# Altium schematic sheet Eurocard VME 3U (3.937 x 8.660 inches).schdoc: Eurocard VME 3U (3.937 x 8.660 inches)
size D; Organization: Organization; Address1: Address1; Address2: Address2; Address3: Address3; Address4: Address4; DocumentNumber: 1; Revision: 0; SheetNumber: 2; SheetTotal: 2
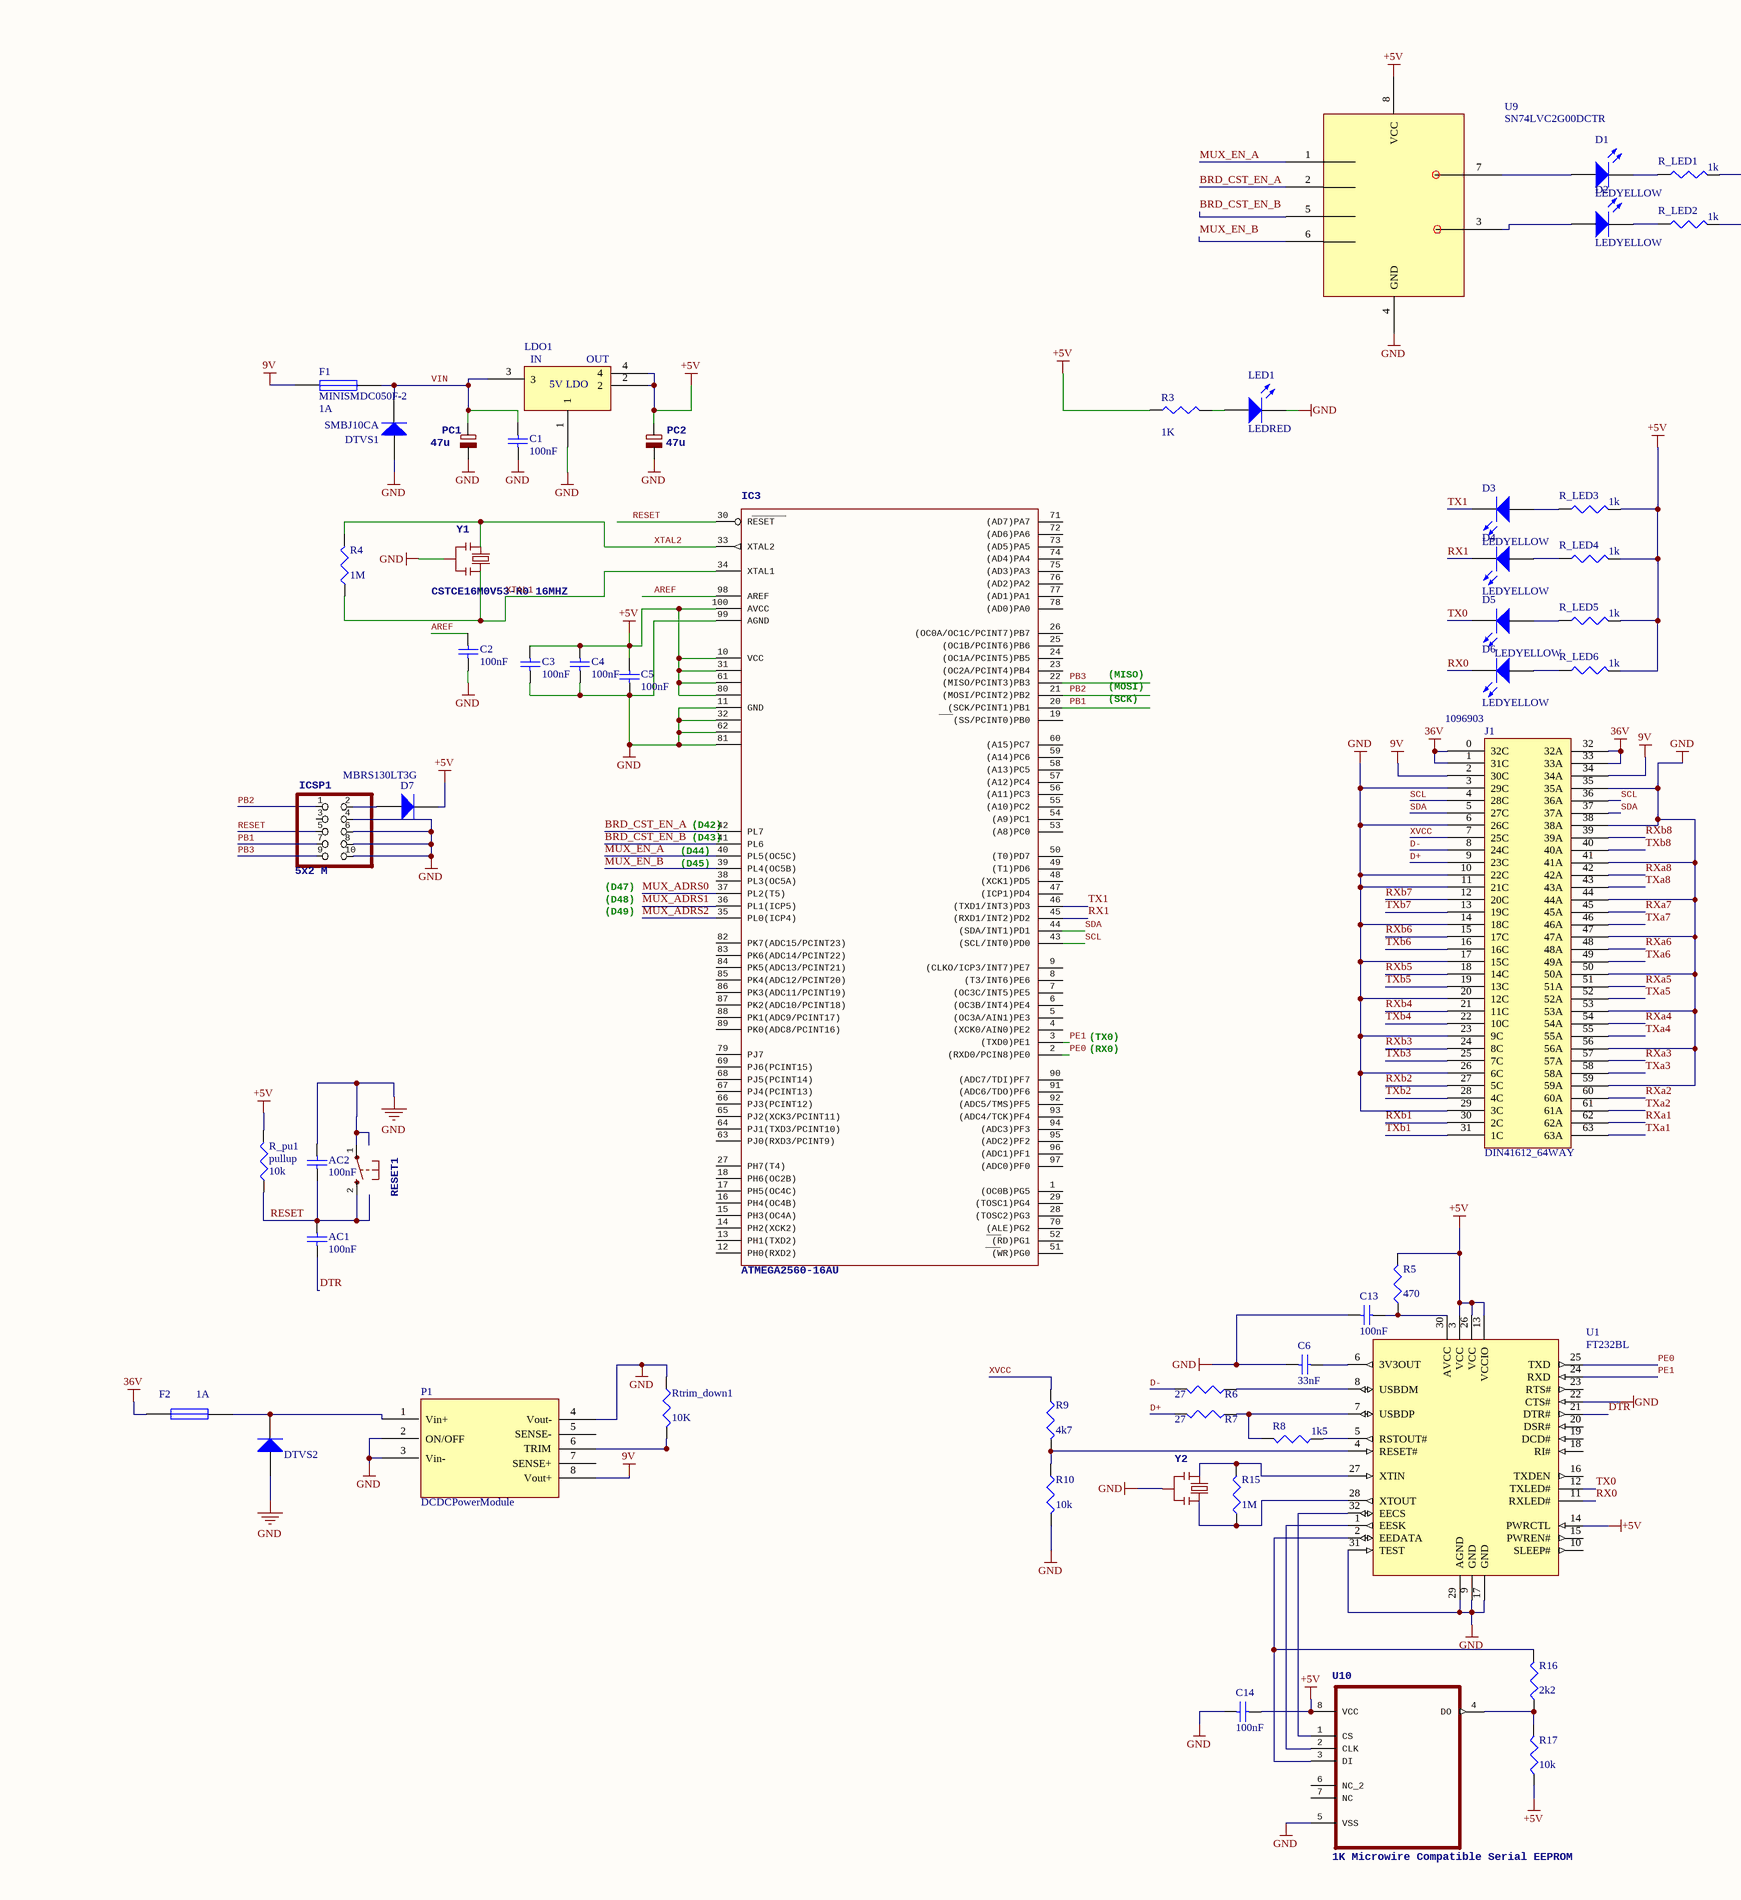
[diagram p0: Eurocard VME 3U (3.937 x 8.660 inches).schdoc, left]
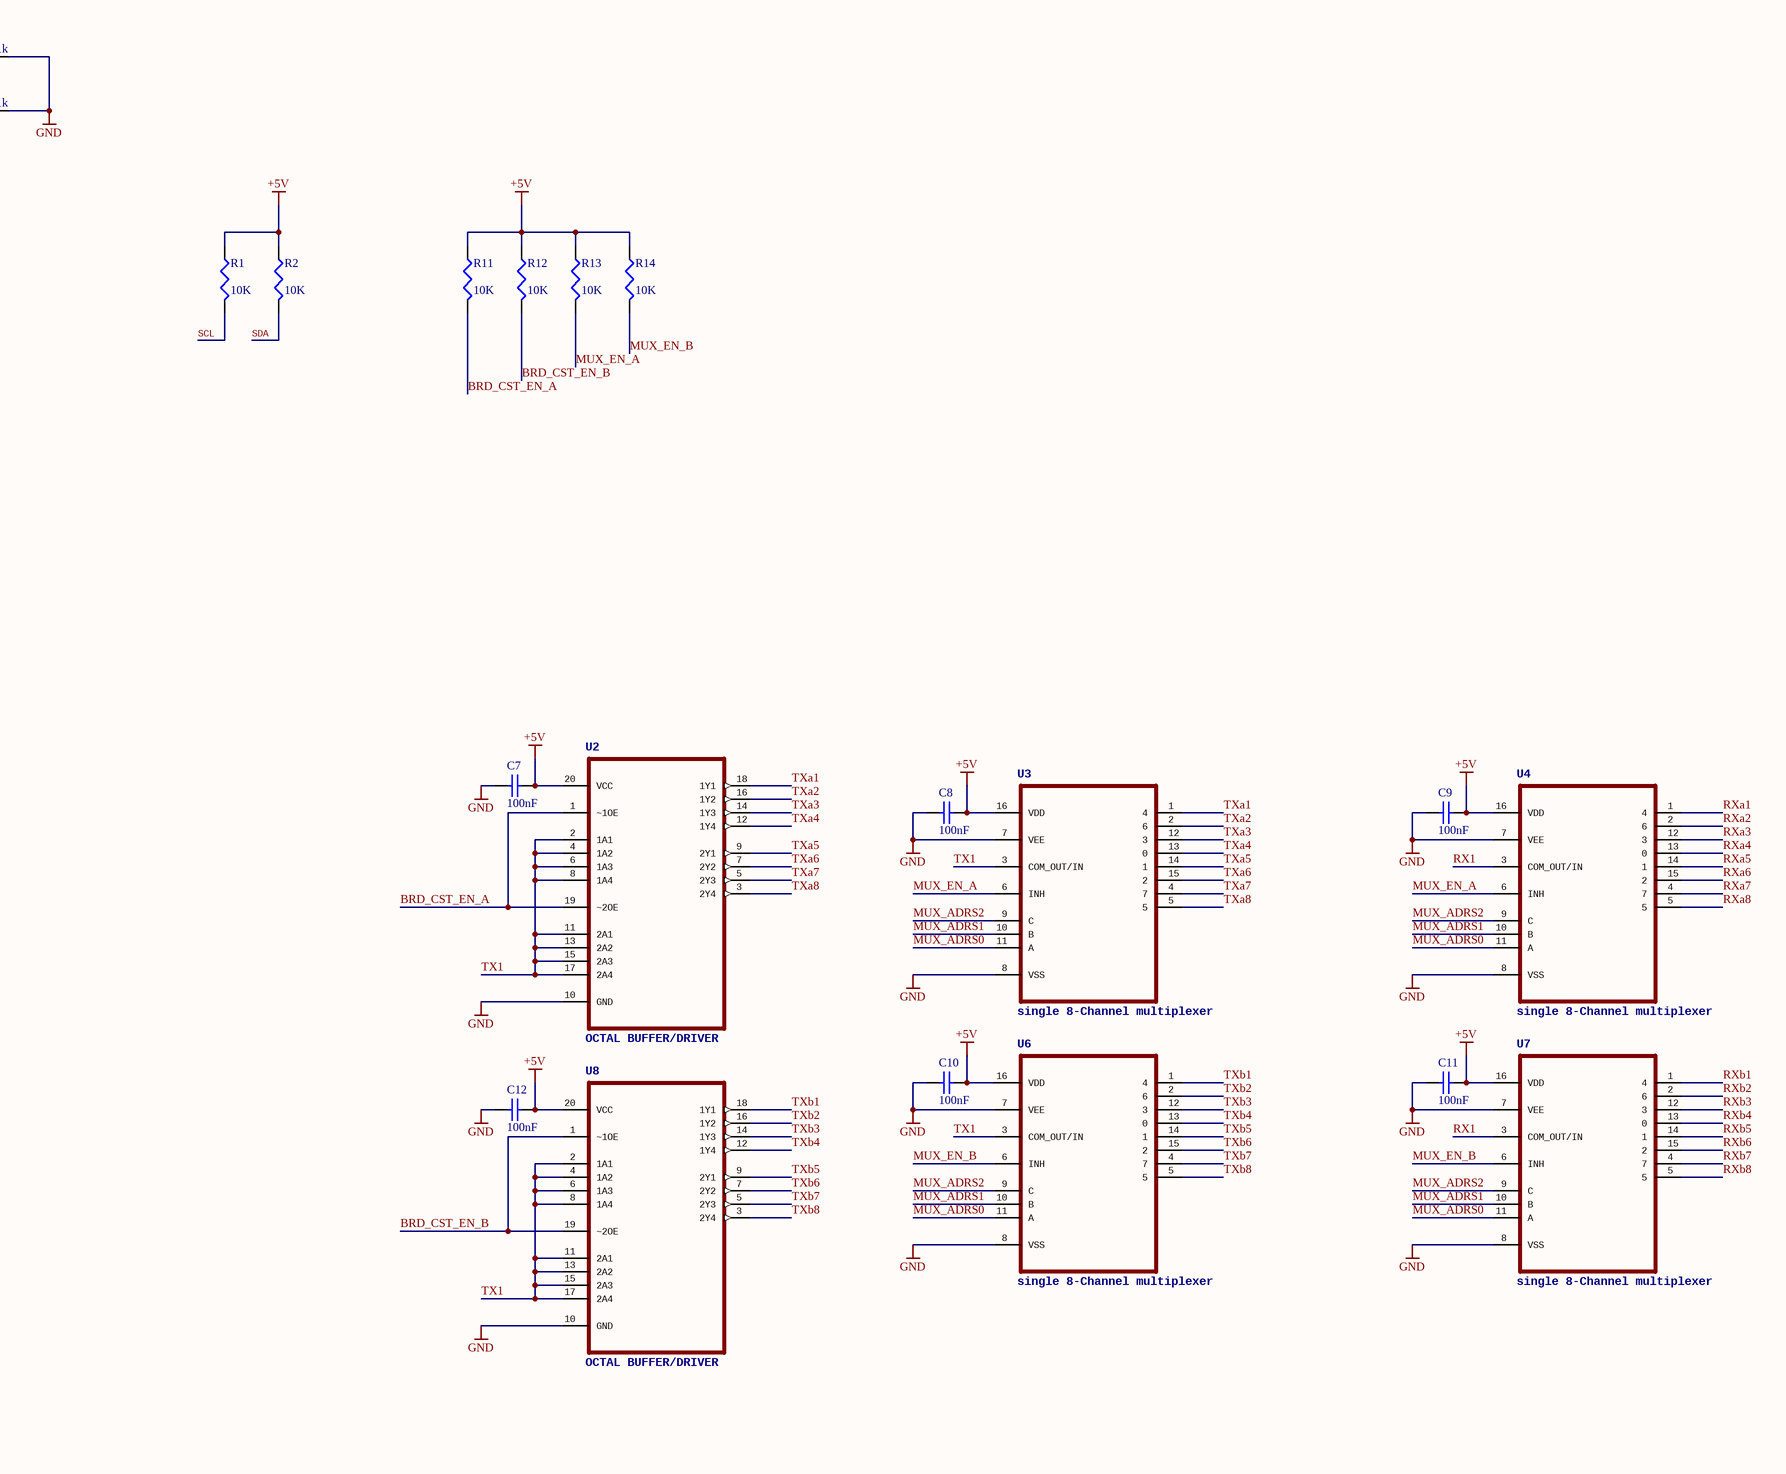
[diagram p1: Eurocard VME 3U (3.937 x 8.660 inches).schdoc, right]

## Parts
AC1  value 100nF  [1608[0603]]  (hidden comment: Cap Semi)
AC2  value 100nF  [1608[0603]]  (hidden comment: Cap Semi)
C1  value 100nF  [1608[0603]]  (hidden comment: Cap Semi)
C2  value 100nF  [1608[0603]]  (hidden comment: Cap Semi)
C3  value 100nF  [1608[0603]]  (hidden comment: Cap Semi)
C4  value 100nF  [1608[0603]]  (hidden comment: Cap Semi)
C5  value 100nF  [1608[0603]]  (hidden comment: Cap Semi)
C6  value 33nF  [1608[0603]]  (hidden comment: Cap Semi)
C7  value 100nF  [1608[0603]]
C8  value 100nF  [1608[0603]]
C9  value 100nF  [1608[0603]]
C10  value 100nF  [1608[0603]]
C11  value 100nF  [1608[0603]]
C12  value 100nF  [1608[0603]]
C13  value 100nF  [1608[0603]]  (hidden comment: Cap Semi)
C14  value 100nF  [1608[0603]]  (hidden comment: Cap Semi)
D1  LEDYELLOW  [LEDYELLOW]
D2  LEDYELLOW  [LEDYELLOW]
D3  LEDYELLOW  [LEDYELLOW]
D4  LEDYELLOW  [LEDYELLOW]
D5  LEDYELLOW  [LEDYELLOW]
D6  LEDYELLOW  [LEDYELLOW]
D7  MBRS130LT3G  [SMB-403A]
DTVS1  SMBJ10CA  [DO-214AA]
DTVS2  SMBJ48A  [SMBJ]  (value not drawn)
F1  MINISMDC050F-2  Tripping current: 1A  [MF-MSMF1]
F2  Tripping current: 1A  [MC33192]
IC3  ATMEGA2560-16AU  [100A_N]
ICSP1  5x2 M  [2X05]
J1  DIN41612_64WAY  Supplier Part Number 1: 1096903  [09 03 164 6919]
LDO1  LDO_5V  [SOT223]  (value not drawn)
LED1  LEDRED  [LEDRED]
P1  DCDCPowerModule  [EHHD006A0B41-HZ]
PC1  47u  [PANASONIC_D]
PC2  47u  [PANASONIC_D]
R1  value 10K  [J1-0603]
R2  value 10K  [J1-0603]
R3  value 1K  [J1-0603]
R4  value 1M  [J1-0603]
R5  value 470  [J1-0603]
R6  value 27  [J1-0603]
R7  value 27  [J1-0603]
R8  value 1k5  [J1-0603]
R9  value 4k7  [J1-0603]
R10  value 10k  [J1-0603]
R11  value 10K  [J1-0603]
R12  value 10K  [J1-0603]
R13  value 10K  [J1-0603]
R14  value 10K  [J1-0603]
R15  value 1M  [J1-0603]
R16  value 2k2  [J1-0603]
R17  value 10k  [J1-0603]
R_LED1  value 1k  [J1-0603]  (hidden comment: Res3)
R_LED2  value 1k  [J1-0603]  (hidden comment: Res3)
R_LED3  value 1k  [J1-0603]  (hidden comment: Res3)
R_LED4  value 1k  [J1-0603]  (hidden comment: Res3)
R_LED5  value 1k  [J1-0603]  (hidden comment: Res3)
R_LED6  value 1k  [J1-0603]  (hidden comment: Res3)
R_pu1  pullup  value 10k  [J1-0603]
RESET1  PB_RST  [1-1825027-4]  (value not drawn)
Rtrim_down1  value 10K  [J1-0603]
U1  FT232BL  [LQFP-32_N]
U2  OCTAL BUFFER/DRIVER  [SOP65P640X120-20N]
U3  single 8-Channel multiplexer  [SOP65P640X120-16N]
U4  single 8-Channel multiplexer  [SOP65P640X120-16N]
U6  single 8-Channel multiplexer  [SOP65P640X120-16N]
U7  single 8-Channel multiplexer  [SOP65P640X120-16N]
U8  OCTAL BUFFER/DRIVER  [SOP65P640X120-20N]
U9  SN74LVC2G00DCTR  [SOP8]
U10  1K Microwire Compatible Serial EEPROM  [SOIC127P600X175-8N]
Y1  CSTCE16M0V53-R0 16MHZ  [RESONATOR]
Y2  (no value)  [CSTCR6M00G53-R0]

## Nets
9V: F1.1 J1.2(30C) J1.34(34A) P1.8(Vout+)
36V: F2.2 J1.0(32C) J1.1(31C) J1.32(32A) J1.33(33A)
+5V: C3.2 C4.2 C5.2 C7.1 C8.1 C9.1 C10.1 C11.1 C12.1 C14.1 D7.1(K) IC3.10(VCC) IC3.31(VCC1) IC3.61(VCC2) IC3.80(VCC3) IC3.100(AVCC) LDO1.2 LDO1.4 PC2.+ R1.1 R2.1 R3.1 R5.2 R11.1 R12.1 R13.1 R14.1 R17.1 R_LED3.2 R_LED4.2 R_LED5.2 R_LED6.2 R_pu1.2 U1.3(VCC) U1.13(VCCIO) U1.14(PWRCTL) U1.26(VCC) U2.20(VCC) U3.16(VDD) U4.16(VDD) U6.16(VDD) U7.16(VDD) U8.20(VCC) U9.8(VCC) U10.8(VCC)
GND: AC2.2 C1.1 C2.1 C3.1 C4.1 C5.1 C6.2 C7.2 C8.2 C9.2 C10.2 C11.2 C12.2 C13.2 C14.2 DTVS1.2(A) DTVS2.2(A) IC3.11(GND) IC3.32(GND1) IC3.62(GND2) IC3.81(GND3) IC3.99(AGND) ICSP1.4 ICSP1.6 ICSP1.8 ICSP1.10 J1.3(29C) J1.6(26C) J1.10(22C) J1.11(21C) J1.14(18C) J1.17(15C) J1.20(12C) J1.23(9C) J1.26(6C) J1.29(3C) J1.35(35A) J1.38(38A) J1.41(41A) J1.44(44A) J1.47(47A) J1.50(50A) J1.53(53A) J1.56(56A) J1.59(59A) LDO1.1 LED1.1(K) P1.2(ON/OFF) P1.3(Vin-) P1.4(Vout-) PC1.- PC2.- R10.2 R_LED1.2 R_LED2.2 RESET1.1 Rtrim_down1.1 U1.9(GND) U1.17(GND) U1.22(CTS#) U1.29(AGND) U1.31(TEST) U2.10(GND) U3.7(VEE) U3.8(VSS) U4.7(VEE) U4.8(VSS) U6.7(VEE) U6.8(VSS) U7.7(VEE) U7.8(VSS) U8.10(GND) U9.4(GND) U10.5(VSS) Y1.2 Y2.2
AREF: C2.2 IC3.98(AREF)
BRD_CST_EN_A: IC3.42(PL7) R11.2 U2.1(~1OE) U2.19(~2OE) U9.2
BRD_CST_EN_B: IC3.41(PL6) R12.2 U8.1(~1OE) U8.19(~2OE) U9.5
D+: J1.9(23C) R7.2
D-: J1.8(24C) R6.2
DTR: AC1.2 U1.21(DTR#)
MUX_ADRS0: IC3.37(PL2(T5)) U3.11(A) U4.11(A) U6.11(A) U7.11(A)
MUX_ADRS1: IC3.36(PL1(ICP5)) U3.10(B) U4.10(B) U6.10(B) U7.10(B)
MUX_ADRS2: IC3.35(PL0(ICP4)) U3.9(C) U4.9(C) U6.9(C) U7.9(C)
MUX_EN_A: IC3.40(PL5(OC5C)) R13.2 U3.6(INH) U4.6(INH) U9.1
MUX_EN_B: IC3.39(PL4(OC5B)) R14.2 U6.6(INH) U7.6(INH) U9.6
PB1: IC3.20((SCK/PCINT1)PB1) ICSP1.7
PB2: IC3.21((MOSI/PCINT2)PB2) ICSP1.1
PB3: IC3.22((MISO/PCINT3)PB3) ICSP1.9
PE0: IC3.2((RXD0/PCIN8)PE0) U1.25(TXD)
PE1: IC3.3((TXD0)PE1) U1.24(RXD)
RESET: AC1.1 AC2.1 IC3.30(RESET) ICSP1.5 R_pu1.1 RESET1.2
RX0: D6.1(K) U1.11(RXLED#)
RX1: D4.1(K) IC3.45((RXD1/INT2)PD2) U4.3(COM_OUT/IN) U7.3(COM_OUT/IN)
RXa1: J1.62(62A) U4.1(4)
RXa2: J1.60(60A) U4.2(6)
RXa3: J1.57(57A) U4.12(3)
RXa4: J1.54(54A) U4.13(0)
RXa5: J1.51(51A) U4.14(1)
RXa6: J1.48(48A) U4.15(2)
RXa7: J1.45(45A) U4.4(7)
RXa8: J1.42(42A) U4.5
RXb1: J1.30(2C) U7.1(4)
RXb2: J1.27(5C) U7.2(6)
RXb3: J1.24(8C) U7.12(3)
RXb4: J1.21(11C) U7.13(0)
RXb5: J1.18(14C) U7.14(1)
RXb6: J1.15(17C) U7.15(2)
RXb7: J1.12(20C) U7.4(7)
RXb8: J1.39(39A) U7.5
SCL: IC3.43((SCL/INT0)PD0) J1.4(28C) J1.36(36A) R1.2
SDA: IC3.44((SDA/INT1)PD1) J1.5(27C) J1.37(37A) R2.2
TX0: D5.1(K) U1.12(TXLED#)
TX1: D3.1(K) IC3.46((TXD1/INT3)PD3) U2.2(1A1) U2.4(1A2) U2.6(1A3) U2.8(1A4) U2.11(2A1) U2.13(2A2) U2.15(2A3) U2.17(2A4) U3.3(COM_OUT/IN) U6.3(COM_OUT/IN) U8.2(1A1) U8.4(1A2) U8.6(1A3) U8.8(1A4) U8.11(2A1) U8.13(2A2) U8.15(2A3) U8.17(2A4)
TXa1: J1.63(63A) U2.18(1Y1) U3.1(4)
TXa2: J1.61(61A) U2.16(1Y2) U3.2(6)
TXa3: J1.58(58A) U2.14(1Y3) U3.12(3)
TXa4: J1.55(55A) U2.12(1Y4) U3.13(0)
TXa5: J1.52(52A) U2.9(2Y1) U3.14(1)
TXa6: J1.49(49A) U2.7(2Y2) U3.15(2)
TXa7: J1.46(46A) U2.5(2Y3) U3.4(7)
TXa8: J1.43(43A) U2.3(2Y4) U3.5
TXb1: J1.31(1C) U6.1(4) U8.18(1Y1)
TXb2: J1.28(4C) U6.2(6) U8.16(1Y2)
TXb3: J1.25(7C) U6.12(3) U8.14(1Y3)
TXb4: J1.22(10C) U6.13(0) U8.12(1Y4)
TXb5: J1.19(13C) U6.14(1) U8.9(2Y1)
TXb6: J1.16(16C) U6.15(2) U8.7(2Y2)
TXb7: J1.13(19C) U6.4(7) U8.5(2Y3)
TXb8: J1.40(40A) U6.5 U8.3(2Y4)
VIN: C1.2 DTVS1.1(K) F1.2 LDO1.3 PC1.+
XTAL1: IC3.34(XTAL1) R4.1 Y1.3
XTAL2: IC3.33(XTAL2) R4.2 Y1.1
XVCC: J1.7(25C) R9.1
NetC6_1: C6.1 U1.6(3V3OUT)
NetC13_1: C13.1 R5.1 U1.30(AVCC)
NetD1_1: D1.1(K) R_LED1.1
NetD1_2: D1.2(A) U9.7
NetD2_1: D2.1(K) R_LED2.1
NetD2_2: D2.2(A) U9.3
NetD3_2: D3.2(A) R_LED3.1
NetD4_2: D4.2(A) R_LED4.1
NetD5_2: D5.2(A) R_LED5.1
NetD6_2: D6.2(A) R_LED6.1
NetD7_2: D7.2(A) ICSP1.2
NetDTVS2_1: DTVS2.1(K) F2.1 P1.1(Vin+)
NetLED1_2: LED1.2(A) R3.2
NetP1_6: P1.6(TRIM) Rtrim_down1.2
NetR6_1: R6.1 U1.8(USBDM)
NetR7_1: R7.1 R8.2 U1.7(USBDP)
NetR8_1: R8.1 U1.5(RSTOUT#)
NetR9_2: R9.2 R10.1 U1.4(RESET#)
NetR15_1: R15.1 U1.28(XTOUT) Y2.3
NetR15_2: R15.2 U1.27(XTIN) Y2.1
NetR16_1: R16.1 R17.2 U10.4(DO)
NetR16_2: R16.2 U1.2(EEDATA) U10.3(DI)
NetU1_1: U1.1(EESK) U10.2(CLK)
NetU1_32: U1.32(EECS) U10.1(CS)

Not connected (* = marked no-connect by the designer): IC3 1((OC0B)PG5) 4((XCK0/AIN0)PE2) 5((OC3A/AIN1)PE3) 6((OC3B/INT4)PE4) 7((OC3C/INT5)PE5) 8((T3/INT6)PE6) 9((CLKO/ICP3/INT7)PE7) 12(PH0(RXD2)) 13(PH1(TXD2)) 14(PH2(XCK2)) 15(PH3(OC4A)) 16(PH4(OC4B)) 17(PH5(OC4C)) 18(PH6(OC2B)) 19((SS/PCINT0)PB0) 23((OC2A/PCINT4)PB4) 24((OC1A/PCINT5)PB5) 25((OC1B/PCINT6)PB6) 26((OC0A/OC1C/PCINT7)PB7) 27(PH7(T4)) 28((TOSC2)PG3) 29((TOSC1)PG4) 38(PL3(OC5A)) 47((ICP1)PD4) 48((XCK1)PD5) 49((T1)PD6) 50((T0)PD7) 51((WR)PG0) 52((RD)PG1) 53((A8)PC0) 54((A9)PC1) 55((A10)PC2) 56((A11)PC3) 57((A12)PC4) 58((A13)PC5) 59((A14)PC6) 60((A15)PC7) 63(PJ0(RXD3/PCINT9)) 64(PJ1(TXD3/PCINT10)) 65(PJ2(XCK3/PCINT11)) 66(PJ3(PCINT12)) 67(PJ4(PCINT13)) 68(PJ5(PCINT14)) 69(PJ6(PCINT15)) 70((ALE)PG2) 71((AD7)PA7) 72((AD6)PA6) 73((AD5)PA5) 74((AD4)PA4) 75((AD3)PA3) 76((AD2)PA2) 77((AD1)PA1) 78((AD0)PA0) 79(PJ7) 82(PK7(ADC15/PCINT23)) 83(PK6(ADC14/PCINT22)) 84(PK5(ADC13/PCINT21)) 85(PK4(ADC12/PCINT20)) 86(PK3(ADC11/PCINT19)) 87(PK2(ADC10/PCINT18)) 88(PK1(ADC9/PCINT17)) 89(PK0(ADC8/PCINT16)) 90((ADC7/TDI)PF7) 91((ADC6/TDO)PF6) 92((ADC5/TMS)PF5) 93((ADC4/TCK)PF4) 94((ADC3)PF3) 95((ADC2)PF2) 96((ADC1)PF1) 97((ADC0)PF0); ICSP1 3; P1 5(SENSE-) 7(SENSE+); U1 10(SLEEP#) 15(PWREN#) 16(TXDEN) 18(RI#) 19(DCD#) 20(DSR#) 23(RTS#); U10 6(NC_2) 7(NC)

## Notes on the sheet
- (MISO)
- (SCK)
- (MOSI)
- (near IC3) (D44)
- (near IC3) (D43)
- (near IC3) (D42)
- (D49)
- (D48)
- (D47)
- (near IC3) (D45)
- (TX0)
- (RX0)
- (in symbol LDO_5V) IN; OUT; 5V LDO

## Library data of the parts
AC1 AC2 C1-C5 C7-C14 = Cap Semi: Capacitor (Semiconductor SIM Model); PartNo: CC0603KRX7R9BB104; Published: 8-Jun-2000; LatestRevisionDate: 29-May-2009; LatestRevisionNote: IPC-7351 Footprint Added.; PackageReference: C1206; Publisher: Altium Limited; PackageDescription: Chip Capacitor
C6 = Cap Semi: Capacitor (Semiconductor SIM Model); PartNo: 0603B332J500CT; Published: 8-Jun-2000; LatestRevisionDate: 29-May-2009; LatestRevisionNote: IPC-7351 Footprint Added.; PackageReference: C1206; Publisher: Altium Limited; PackageDescription: Chip Capacitor
D1-D6 = LEDYELLOW: PartNo: 550-0307F
D7 = MBRS130LT3G: Power Diode; Note: Pin 2 is not connected and not drawn.; Published: 21-Mar-2003; LatestRevisionDate: 29-May-2009; LatestRevisionNote: IPC-7351 Footprint Added.; DatasheetVersion: Oct-1999; PackageVersion: Sep-2001; PackageReference: SOT-23; Publisher: Altium Limited; PackageDescription: 3-Pin SOT-23 Package 0.95 mm Pitch, 2.5 mm Lead Span; ComponentLink1Description: Manufacturer Link; ComponentLink1URL: http://www.infineon.com/; ComponentLink2Description: Datasheet; ComponentLink2URL: http://www.infineon.com/upload/Document/cmc_upload/documents/080/656/bas116series.pdf; PartNo: MBRS130LT3G
DTVS1 = SMBJ: TVS; Note: Pin 2 is not connected and not drawn.; Published: 21-Mar-2003; LatestRevisionDate: 29-May-2009; LatestRevisionNote: IPC-7351 Footprint Added.; DatasheetVersion: Oct-1999; PackageVersion: Sep-2001; PackageReference: SOT-23; Publisher: Altium Limited; PackageDescription: 3-Pin SOT-23 Package 0.95 mm Pitch, 2.5 mm Lead Span; ComponentLink1Description: Manufacturer Link; ComponentLink1URL: http://www.infineon.com/; ComponentLink2Description: Datasheet; ComponentLink2URL: http://www.infineon.com/upload/Document/cmc_upload/documents/080/656/bas116series.pdf; PartNo: SMBJ10CA
DTVS2 = SMBJ: TVS; PartNo: SMBJ36A; Note: Pin 2 is not connected and not drawn.; Published: 21-Mar-2003; LatestRevisionDate: 29-May-2009; LatestRevisionNote: IPC-7351 Footprint Added.; DatasheetVersion: Oct-1999; PackageVersion: Sep-2001; PackageReference: SOT-23; Publisher: Altium Limited; PackageDescription: 3-Pin SOT-23 Package 0.95 mm Pitch, 2.5 mm Lead Span; ComponentLink1Description: Manufacturer Link; ComponentLink1URL: http://www.infineon.com/; ComponentLink2Description: Datasheet; ComponentLink2URL: http://www.infineon.com/upload/Document/cmc_upload/documents/080/656/bas116series.pdf
F1 F2 = Fuse 1: Fuse; Published: 8-Jun-2000; LatestRevisionDate: 17-Jul-2002; LatestRevisionNote: Re-released for DXP Platform.; PackageReference: PIN-W2/E2.8; Publisher: Altium Limited; PackageDescription: Thru-Hole; 2 Leads
  F1: PartNo: MINISMDC050F-2
  F2: PartNo: MC33192
IC3 = ATMEGA2560AU: MICROCONTROLLER   64/128/256 Kbytes FLASH   4 Kbytes EEPROM   8 Kbytes SRAM   86 General Purpose I/O pins   12-channels16-bit PWM   4 x Serial USARTs   16-channels 10-bit A/D; PartNo: ATMEGA2560-16AU
ICSP1 = PINHD-2X5: PartNo: 2-1761605-3
J1 = DIN41612_64WAY: PartNo: 0903 164 6921; Supplier 1: Farnell
LDO1 = LDO_5V: PartNo: NCP1117ST50T3G
LED1 = LEDRED: PartNo: 550-0407F
PC1 PC2 = CPOL-EUD: POLARIZED CAPACITOR, European symbol; PartNo: EEE1EA470WAP; Value: 47uF
R1-R17 R_LED1-R_LED6 R_pu1 Rtrim_down1 = Res3: Resistor; Published: 8-Jun-2000; LatestRevisionDate: 29-May-2009; LatestRevisionNote: IPC-7351 Footprint Added.; PackageReference: J1-0603; Publisher: Altium Limited; PackageDescription: Chip Resistor
U1 = FT232BL: USB UART Asynchronous Serial Data Transfer Chip, 0 to +70 degC, 32-pin LQFP, Pb-Free; Manufacturer: FTDI; DatasheetVersion: ver 2.2, Nov-2011; PackageVersion: Nov-11; PackageReference: LQFP-32; PackageDescription: 32-Pin Thin Quad Flat Pack, 7 x 7 mm Body, 0.8 mm Pitch; PartNumber: FT232BL; ComponentLink1Description: Manufacturer URL; ComponentLink1URL: http://www.ftdichip.com/; ComponentLink2Description: Datasheet; ComponentLink2URL: http://www.ftdichip.com/Support/Documents/DataSheets/ICs/DS_FT232BL_BQ.pdf; PartNo: FT232BL
U2 U8 = SN74LVC244APWR: PartNo: SN74LVC244APWR; OC_FARNELL: 1105933; OC_NEWARK: 10C2401; PACKAGE: TSSOP-20; SUPPLIER: Texas Instruments
U3 U4 U6 U7 = CD4051BPW: PartNo: CD4051BPW; OC_FARNELL: 1753421; OC_NEWARK: -; PACKAGE: TSSOP-16; SUPPLIER: Texas Instruments
U10 = 93LC46B-I/SN: PartNo: 93LC46B-I/SN; OC_FARNELL: 9758232; OC_NEWARK: 12C2033; PACKAGE: SOIC-8; SUPPLIER: MICROCHIP
Y1 Y2 = RESONATORMU
  Y1: PartNo: CSTCE16M0V53-R0
  Y2: PartNo: CSTCR6M00G53-R0
P1 = DCDCPowerModule: PartNo: EHHD006A0B41-HZ
RESET1 = PB_RST: PartNo: 1-1825027-4
U9 = SN74LVC2G00DCTR: PartNo: SN74LVC2G00DCTR